# EasyEDA schematic Voltage Mode Buck- Voltage_Current Control Module.json

## Sheets
1 Sheet_1: TITLE: Sheet_1; REV: 1.0; Date: 2019-04-22; Sheet: 1/1; Drawn By: neutronstriker; Company: Your Company
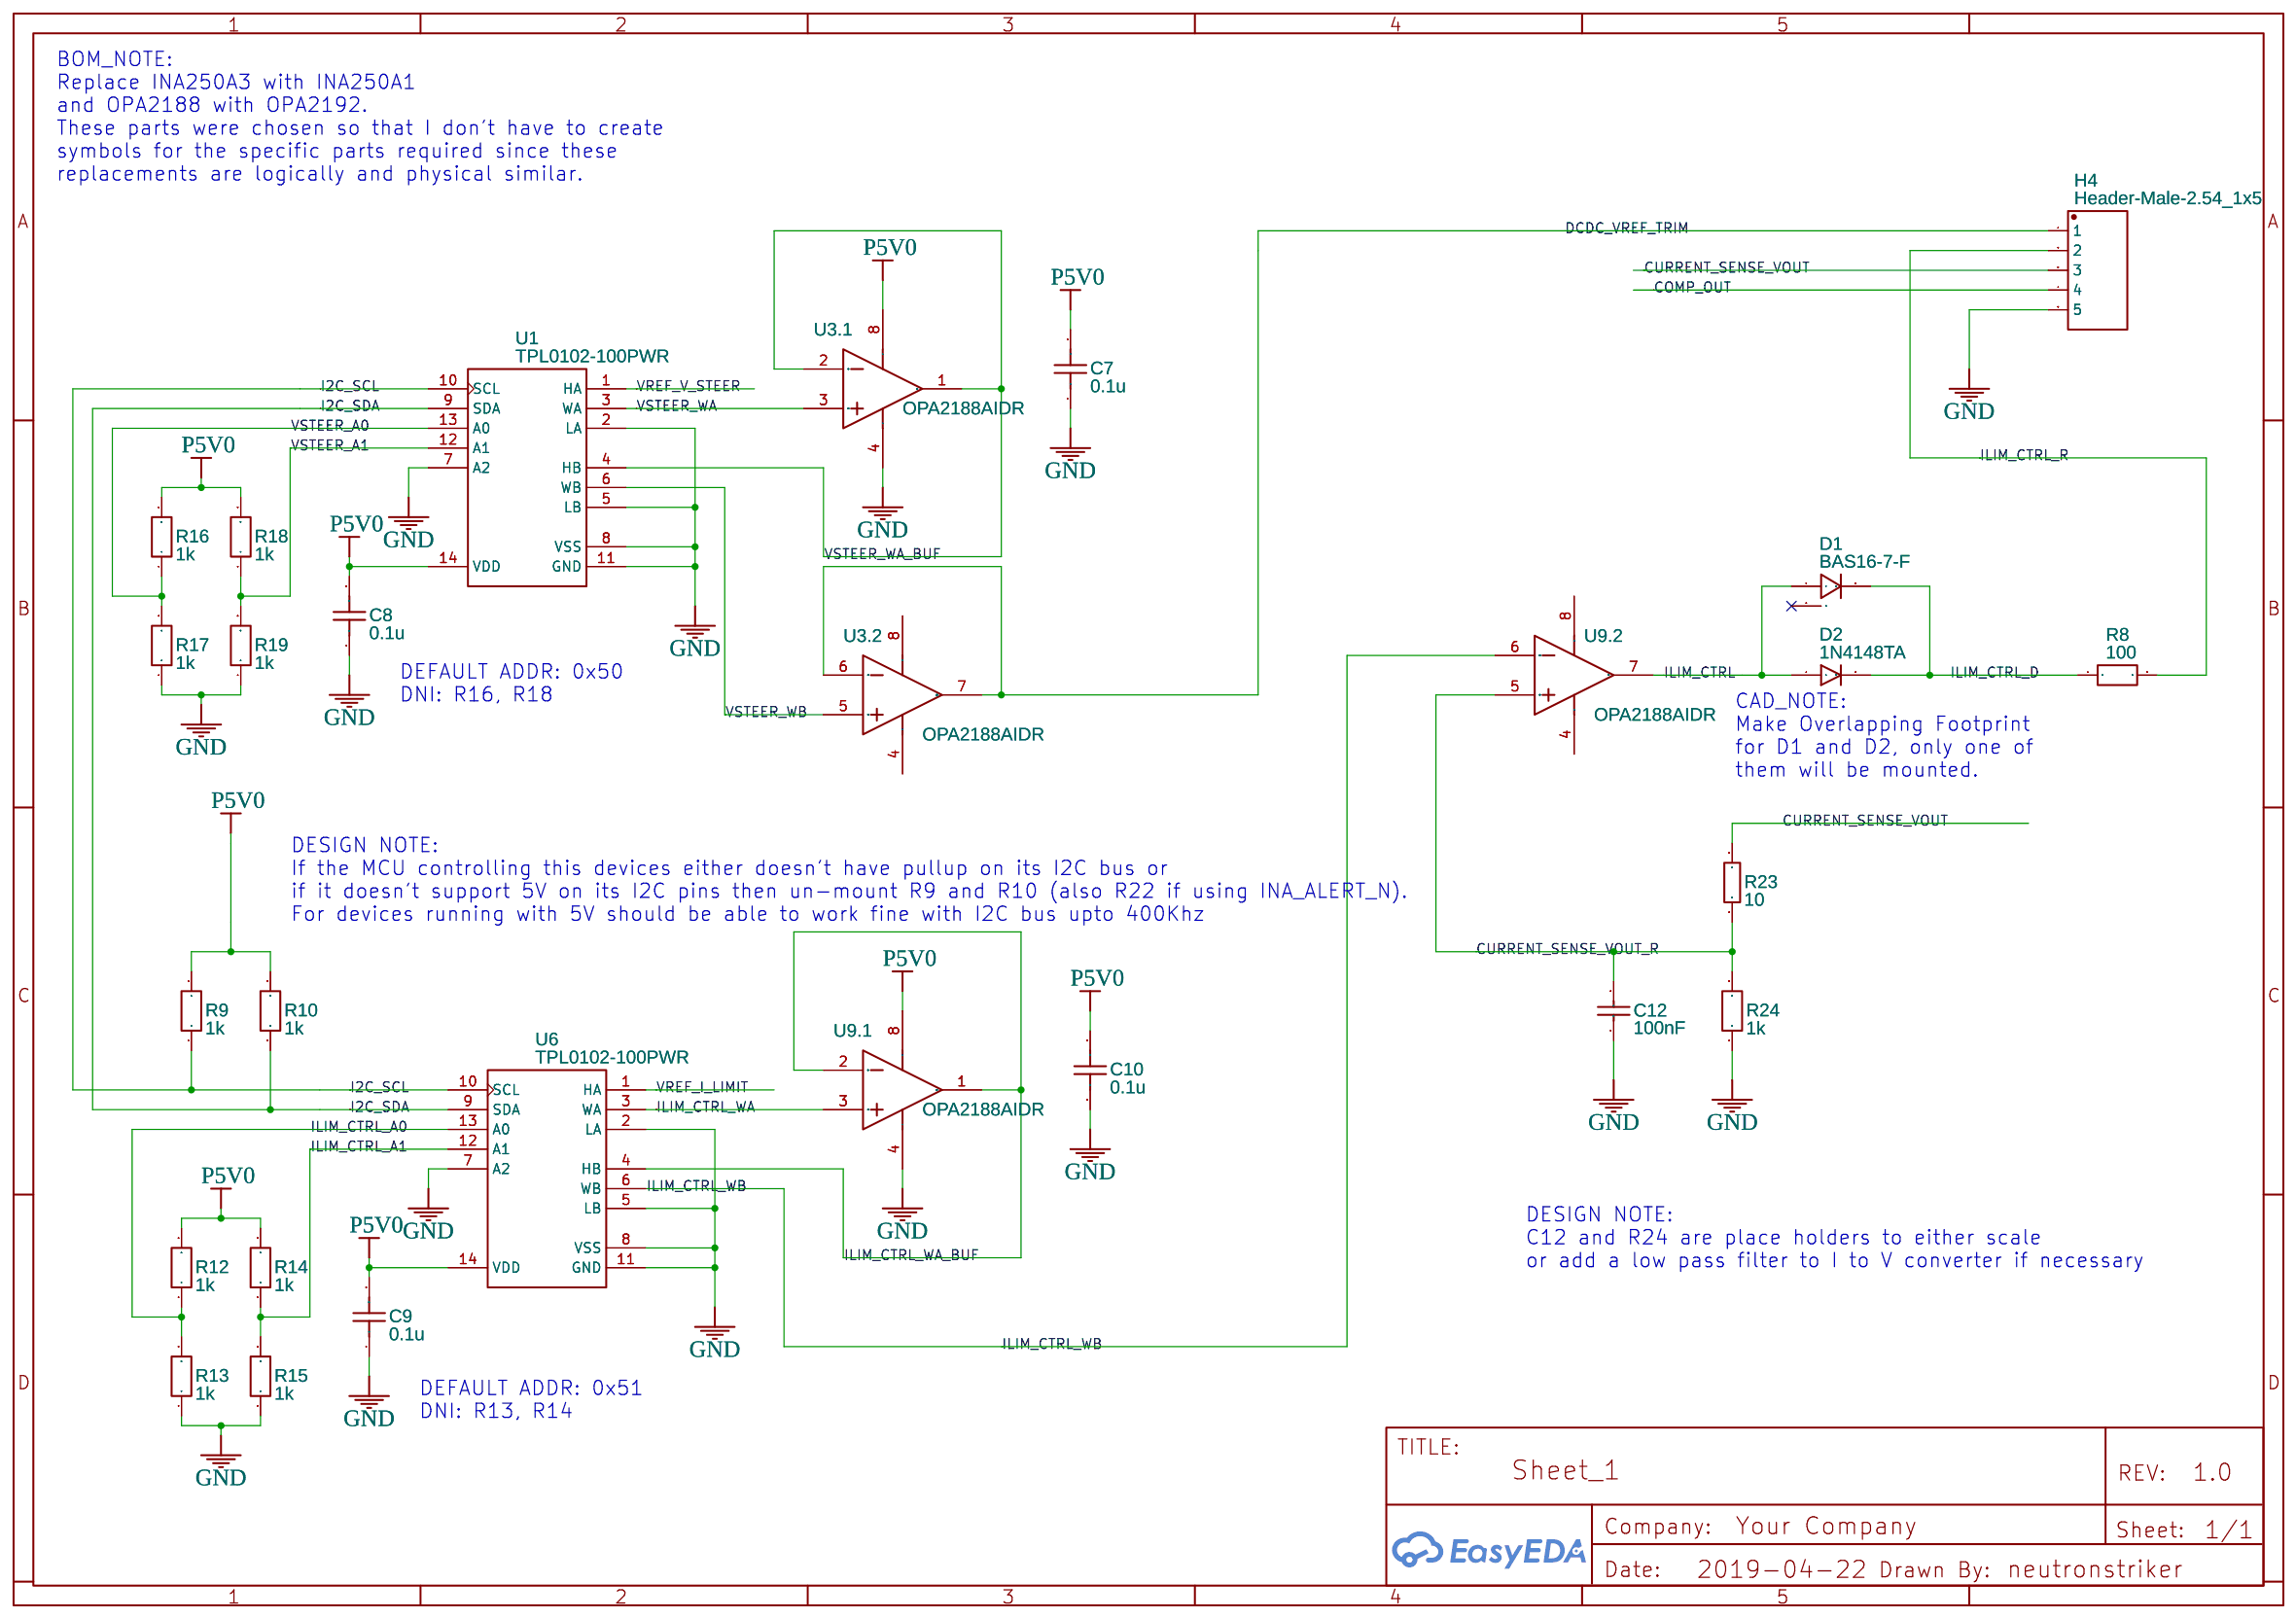
[diagram p0: Sheet_1]
2 Sheet_2: TITLE: Sheet_2; Date: 2019-05-24
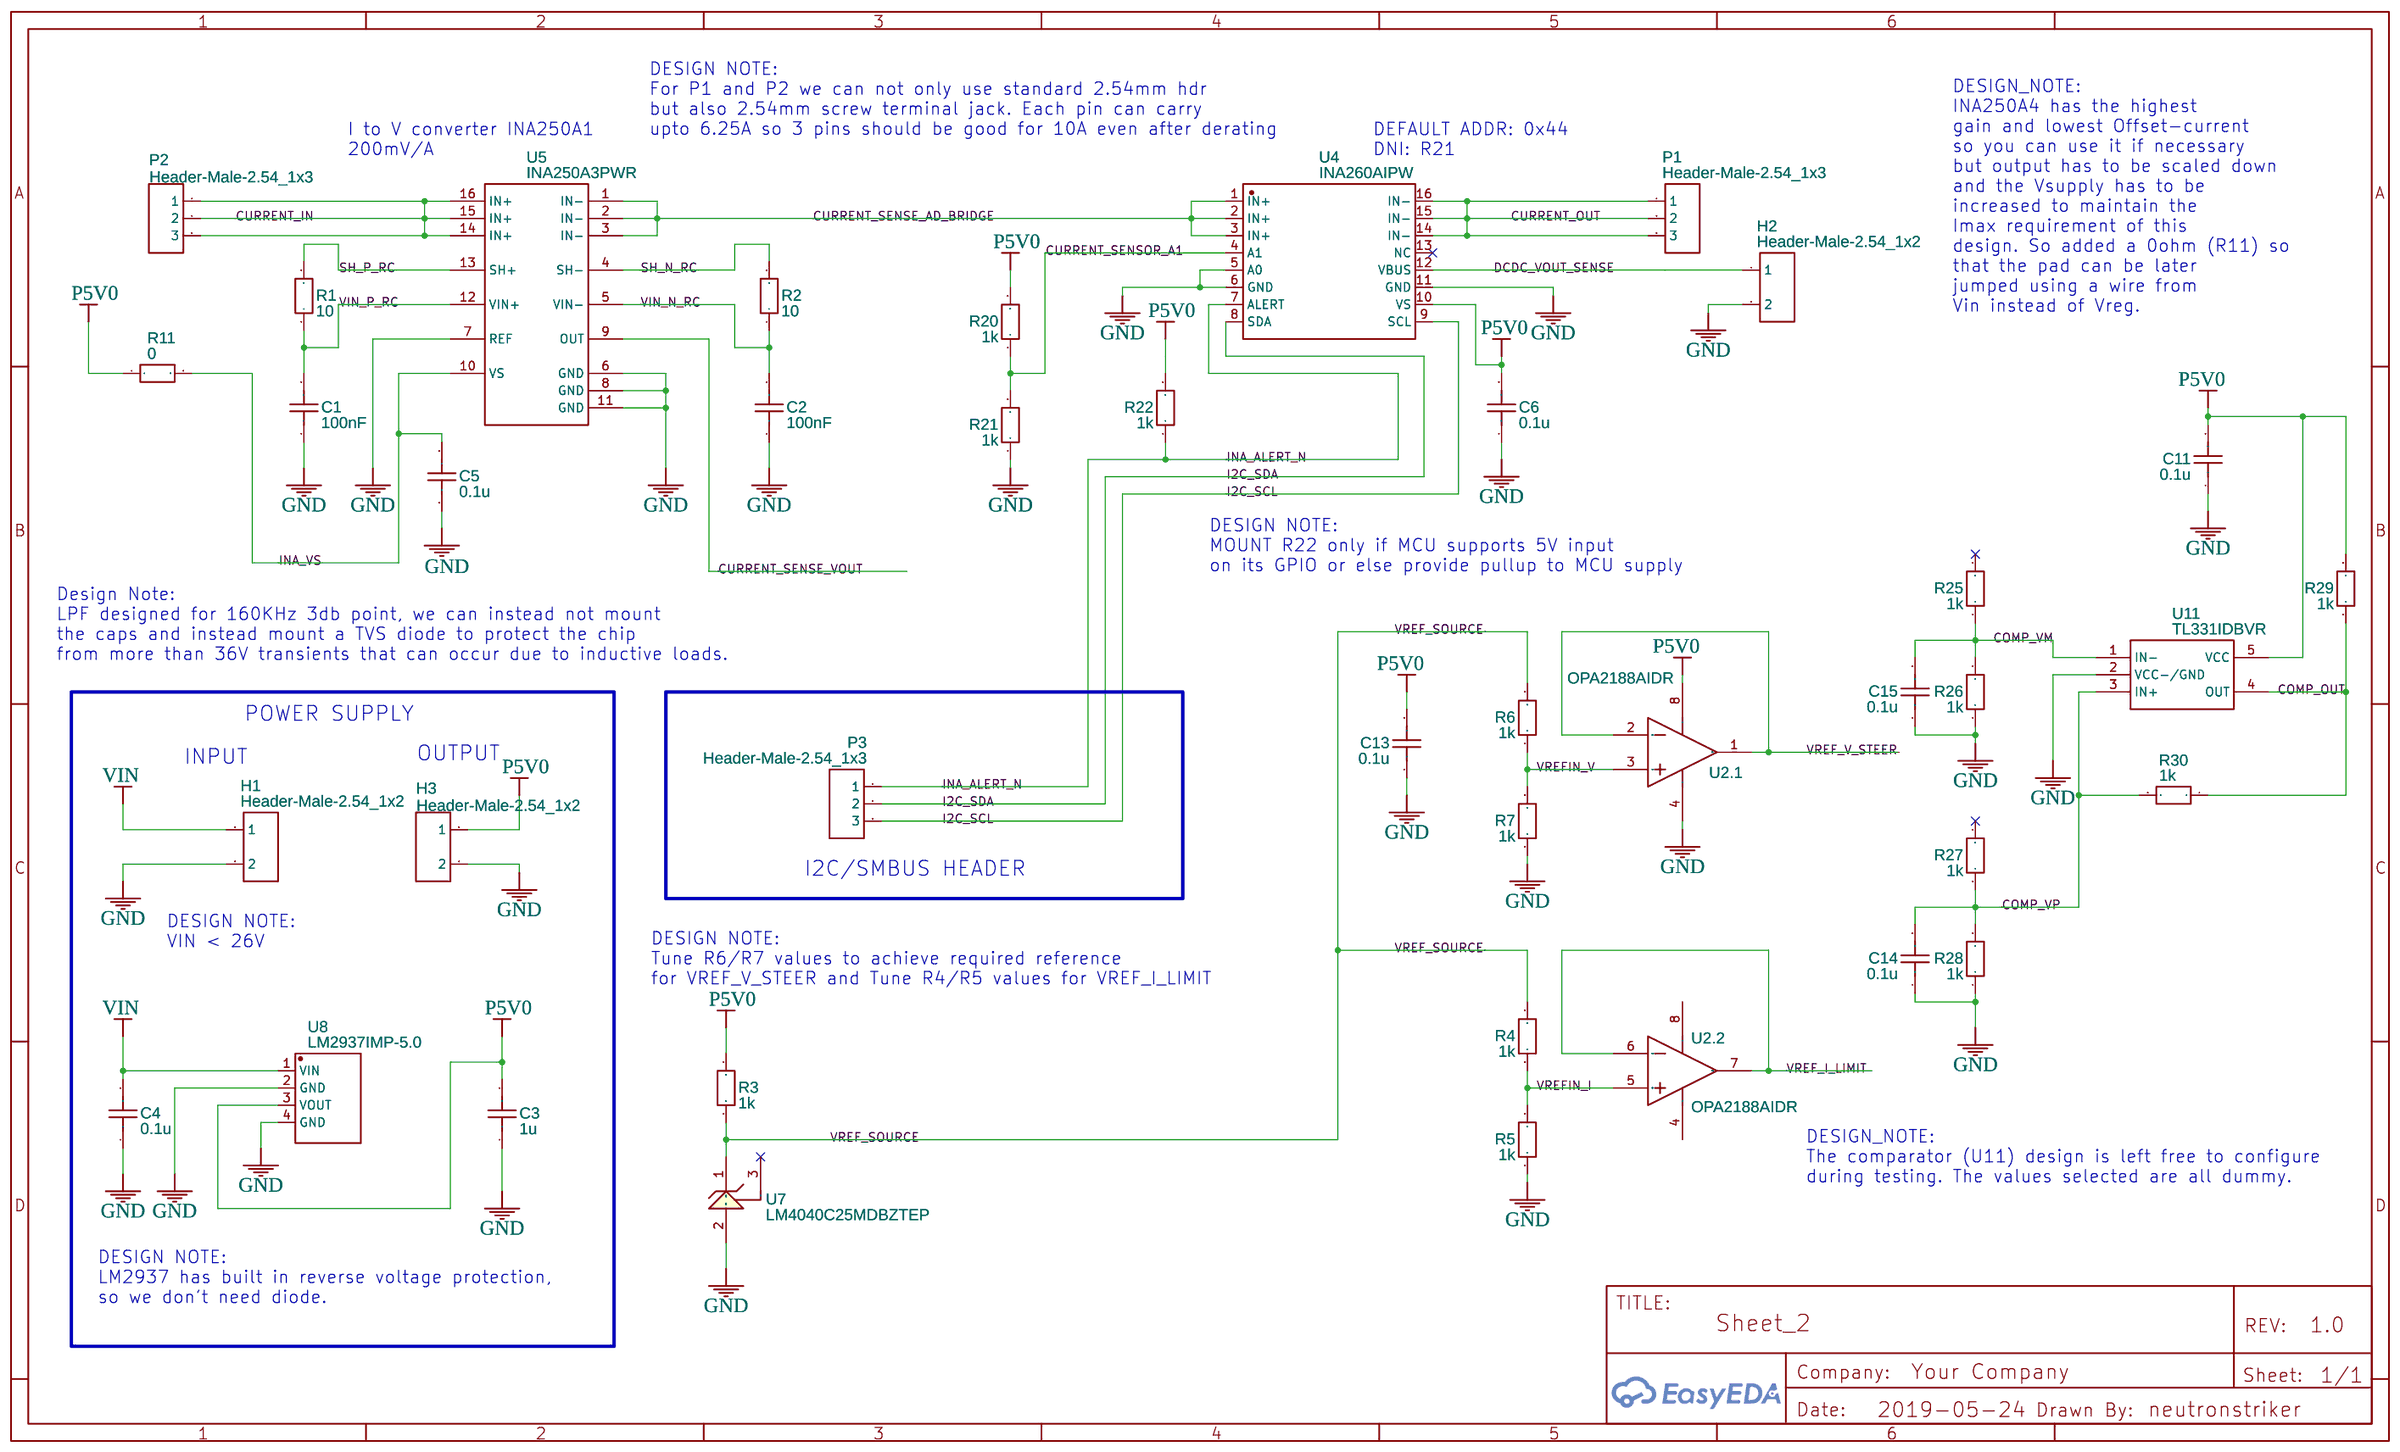
[diagram p1: Sheet_2]

## Parts
sheet Sheet_1
C7  0.1u  [0805]
C8  0.1u  [0805]
C9  0.1u  [0805]
C10  0.1u  [0805]
C12  100nF  [0805]
D1  BAS16-7-F  [SOT-23(SOT-23-3)]
D2  1N4148TA  [DO-35]
H4  Header-Male-2.54_1x5  [DIP-1X5P-2.54MM-M]
R8  100  [0805]
R9  1k  [0805]
R10  1k  [0805]
R12  1k  [0805]
R13  1k  [0805]
R14  1k  [0805]
R15  1k  [0805]
R16  1k  [0805]
R17  1k  [0805]
R18  1k  [0805]
R19  1k  [0805]
R23  10  [0805]
R24  1k  [0805]
U1  TPL0102-100PWR  [TSSOP-14]
U3  OPA2188AIDR  [SOIC-8_150MIL]  (sections 1,2)
U6  TPL0102-100PWR  [TSSOP-14]
U9  OPA2188AIDR  [SOIC-8_150MIL]  (sections 1,2)
sheet Sheet_2
C1  100nF  [0402]
C2  100nF  [0402]
C3  1u  [0805]
C4  0.1u  [0805]
C5  0.1u  [0805]
C6  0.1u  [0805]
C11  0.1u  [0805]
C13  0.1u  [0805]
C14  0.1u  [0805]
C15  0.1u  [0805]
H1  Header-Male-2.54_1x2  [HDR-2X1/2.54]
H2  Header-Male-2.54_1x2  [HDR-2X1/2.54]
H3  Header-Male-2.54_1x2  [HDR-2X1/2.54]
P1  Header-Male-2.54_1x3  [HDR-3X1/2.54]
P2  Header-Male-2.54_1x3  [HDR-3X1/2.54]
P3  Header-Male-2.54_1x3  [HDR-3X1/2.54]
R1  10  [0402]
R2  10  [0402]
R3  1k  [0805]
R4  1k  [0805]
R5  1k  [0805]
R6  1k  [0805]
R7  1k  [0805]
R11  0  [0805]
R20  1k  [0805]
R21  1k  [0805]
R22  1k  [0805]
R25  1k  [0805]
R26  1k  [0805]
R27  1k  [0805]
R28  1k  [0805]
R29  1k  [0805]
R30  1k  [0805]
U2  OPA2188AIDR  [SOIC-8_150MIL]  (sections 1,2)
U4  INA260AIPW  [TSSOP-16]
U5  INA250A3PWR  [TSSOP-16]
U7  LM4040C25MDBZTEP  [SOT23-3]
U8  LM2937IMP-5.0  [SOT-223]
U11  TL331IDBVR  [SOT-23-5]

## Library data of the parts
C3-C11 C13-C15 = Cap_0805_US: Manufacturer Part: ?
C12 = CL21B104JBCNNNC: Supplier: LCSC; Manufacturer: SAMSUNG; Supplier Part: C62912; LCSC Assembly: Yes; SMT Type: Extend; MOUNT: NO
D1 = -: Supplier Part: C69162; Supplier: LCSC; Manufacturer: DIODES; Contributor: LCSC; LCSC Assembly: Yes; SMT Type: Extend
D2 = -: Supplier: LCSC; Manufacturer: FAIRCHILD; Contributor: LCSC; Supplier Part: C124481
H4 = -: Supplier: LCSC; Manufacturer: Ckmtw; Manufacturer Part: 210S-1*5P L=11.6MMGold-plated black; Contributor: LCSC; Supplier Part: C124379
R3 R4 R6-R12 R15 R17 R19 R20 R25-R30 = Res_0805(1/8W)_EU: Manufacturer Part: ?
R5 R13 R14 R16 R18 R21 R22 R24 = Res_0805(1/8W)_EU: Manufacturer Part: ?; MOUNT: NO
R23 = AC0805FR-0710RL: Supplier: LCSC; Manufacturer: YAGEO; Supplier Part: C138273
U1 U6 = -: 256 Tap Dual Channel Digital Potentiometer with I2C Interface and Non-Volatile Memory, -40 to 85 degC, 14-pin SOP (PW14), Green (RoHS  no SbBr); Manufacturer Part: ?
U2 U3 U9 = -: tags: Precision Operational Amplifier; Supplier Part: C17271; Supplier: LCSC; Manufacturer: TI; subpart_no: 1; image: http://image.lceda.cn/szlcsc/C17271.jpg
C1 C2 = Cap_0402_US: Manufacturer Part: ?
H1-H3 = -: Supplier: LCSC; Manufacturer: TE Connectivity; Manufacturer Part: 826629-2; image: //image.lceda.cn/szlcsc/C86471.jpg; Supplier Part: C86471
P1-P3 = -: Supplier: LCSC; Manufacturer: BOOMELE; Manufacturer Part: Header2.54mm 1*3P; image: //image.lceda.cn/szlcsc/C49257.jpg; Supplier Part: C49257
R1 R2 = Res_0402(1/16W)_EU: Manufacturer Part: ?
U4 = -: Supplier: LCSC; Supplier Part: C181331; Manufacturer: Texas Instruments; Contributor: LCSC
U5 = -: Supplier: LCSC; Supplier Part: C122578; Manufacturer: Texas Instruments; Contributor: neutronstriker; LCSC Assembly: Yes; SMT Type: Extend
U7 = -: Enhanced Product Precision Micropower Shunt Voltage Reference, 0.5% accuracy, 15 ppm  degC, 15 mA, -55 to 125 degC, 3-pin SOT-23 (DBZ), Green (RoHS  no SbBr); Manufacturer Part: ?
U8 = -: Supplier: LCSC; Manufacturer: TI; image: //image.lceda.cn/szlcsc/C42249.jpg; Supplier Part: C42249
U11 = -: Supplier: LCSC; Manufacturer: TI; Supplier Part: C80942; LCSC Assembly: Yes; SMT Type: Extend

## Nets
GND: C1.1 C2.1 C3.1 C4.1 C5.1 C6.1 C7.1 C8.1 C9.1 C10.1 C11.1 C12.1 C13.1 C14.1 C15.1 H1.2 H2.2 H3.2 H4.5 R5.1 R7.1 R13.1 R15.1 R17.1 R19.1 R21.1 R24.1 R26.1 R28.1 U1.2(LA) U1.5(LB) U1.7(A2) U1.8(VSS) U1.11(GND) U2.4(V-) U3.4(V-) U4.5(A0) U4.6(GND) U4.11(GND) U5.6(GND) U5.7(REF) U5.8(GND) U5.11(GND) U6.2(LA) U6.5(LB) U6.7(A2) U6.8(VSS) U6.11(GND) U7.2(ANODE) U8.2(GND) U8.4(GND) U9.4(V-) U11.2(VCC-/GND)
P5V0: C3.2 C6.2 C7.2 C8.2 C9.2 C10.2 C11.2 C13.2 H3.1 R3.2 R9.2 R10.2 R11.1 R12.2 R14.2 R16.2 R18.2 R20.2 R22.2 R29.2 U1.14(VDD) U2.8(V+) U3.8(V+) U4.10(VS) U6.14(VDD) U8.3(VOUT) U9.8(V+) U11.5(VCC)
VIN: C4.2 H1.1 U8.1(VIN)
VIN_N_RC: C2.2 R2.1 U5.5(VIN-)
VIN_P_RC: C1.2 R1.1 U5.12(VIN+)
COMP_OUT: H4.4 R29.1 R30.1 U11.4(OUT)
COMP_VM: C15.2 R25.1 R26.2 U11.1(IN-)
COMP_VP: C14.2 R27.1 R28.2 R30.2 U11.3(IN+)
CURRENT_IN: P2.1 P2.2 P2.3 U5.14(IN+) U5.15(IN+) U5.16(IN+)
CURRENT_OUT: P1.1 P1.2 P1.3 U4.14(IN-) U4.15(IN-) U4.16(IN-)
CURRENT_SENSE_AD_BRIDGE: U4.1(IN+) U4.2(IN+) U4.3(IN+) U5.1(IN-) U5.2(IN-) U5.3(IN-)
CURRENT_SENSE_VOUT: H4.3 R23.2 U5.9(OUT)
CURRENT_SENSE_VOUT_R: C12.2 R23.1 R24.2 U9.5(IN B+)
CURRENT_SENSOR_A1: R20.1 R21.2 U4.4(A1)
DCDC_VOUT_SENSE: H2.1 U4.12(VBUS)
DCDC_VREF_TRIM: H4.1 U3.6(IN B-) U3.7(OUT B)
I2C_SCL: P3.3 R9.1 U1.10(SCL) U4.9(SCL) U6.10(SCL)
I2C_SDA: P3.2 R10.1 U1.9(SDA) U4.8(SDA) U6.9(SDA)
ILIM_CTRL: D1.1(A) D2.1 U9.7(OUT B)
ILIM_CTRL_A0: R12.1 R13.2 U6.13(A0)
ILIM_CTRL_A1: R14.1 R15.2 U6.12(A1)
ILIM_CTRL_D: D1.3(C) D2.2 R8.1
ILIM_CTRL_R: H4.2 R8.2
ILIM_CTRL_WA: U6.3(WA) U9.3(IN A+)
ILIM_CTRL_WA_BUF: U6.4(HB) U9.1(OUT A) U9.2(IN A-)
ILIM_CTRL_WB: U6.6(WB) U9.6(IN B-)
INA_ALERT_N: P3.1 R22.1 U4.7(ALERT)
INA_VS: C5.2 R11.2 U5.10(VS)
SH_N_RC: R2.2 U5.4(SH-)
SH_P_RC: R1.2 U5.13(SH+)
VREF_I_LIMIT: U2.6(IN B-) U2.7(OUT B) U6.1(HA)
VREF_SOURCE: R3.1 R4.2 R6.2 U7.1(CATHODE)
VREF_V_STEER: U1.1(HA) U2.1(OUT A) U2.2(IN A-)
VREFIN_I: R4.1 R5.2 U2.5(IN B+)
VREFIN_V: R6.1 R7.2 U2.3(IN A+)
VSTEER_A0: R16.1 R17.2 U1.13(A0)
VSTEER_A1: R18.1 R19.2 U1.12(A1)
VSTEER_WA: U1.3(WA) U3.3(IN A+)
VSTEER_WA_BUF: U1.4(HB) U3.1(OUT A) U3.2(IN A-)
VSTEER_WB: U1.6(WB) U3.5(IN B+)

Not connected (* = marked no-connect by the designer): D1 2*; R25 2*; R27 2*; U4 13(NC)*; U7 3(NC)*

## Notes on the sheets
sheet 1
- BOM_NOTE:
  Replace INA250A3 with INA250A1
  and OPA2188 with OPA2192.
  These parts were chosen so that I don't have to create
  symbols for the specific parts required since these
  replacements are logically and physical similar.
- DEFAULT ADDR: 0x50
  DNI: R16, R18
- CAD_NOTE:
  Make Overlapping Footprint
  for D1 and D2, only one of
  them will be mounted.
- DESIGN NOTE:
  If the MCU controlling this devices either doesn't have pullup on its I2C bus or
  if it doesn't support 5V on its I2C pins then un-mount R9 and R10 (also R22 if using INA_ALERT_N).
  For devices running with 5V should be able to work fine with I2C bus upto 400Khz
- DESIGN NOTE:
  C12 and R24 are place holders to either scale
  or add a low pass filter to I to V converter if necessary
- DEFAULT ADDR: 0x51
  DNI: R13, R14
sheet 2
- DESIGN NOTE:
  For P1 and P2 we can not only use standard 2.54mm hdr
  but also 2.54mm screw terminal jack. Each pin can carry
  upto 6.25A so 3 pins should be good for 10A even after derating
- DESIGN_NOTE:
  INA250A4 has the highest
  gain and lowest Offset-current
  so you can use it if necessary
  but output has to be scaled down
  and the Vsupply has to be
  increased to maintain the
  Imax requirement of this
  design. So added a 0ohm (R11) so
  that the pad can be later
  jumped using a wire from
  Vin instead of Vreg.
- I to V converter INA250A1
  200mV/A
- DEFAULT ADDR: 0x44
  DNI: R21
- DESIGN NOTE:
  MOUNT R22 only if MCU supports 5V input
  on its GPIO or else provide pullup to MCU supply
- Design Note:
  LPF designed for 160KHz 3db point, we can instead not mount
  the caps and instead mount a TVS diode to protect the chip
  from more than 36V transients that can occur due to inductive loads.
- POWER SUPPLY
- INPUT
- OUTPUT
- I2C/SMBUS HEADER
- DESIGN NOTE:
  VIN < 26V
- DESIGN NOTE:
  Tune R6/R7 values to achieve required reference
  for VREF_V_STEER and Tune R4/R5 values for VREF_I_LIMIT
- DESIGN_NOTE:
  The comparator (U11) design is left free to configure
  during testing. The values selected are all dummy.
- DESIGN NOTE:
  LM2937 has built in reverse voltage protection,
  so we don't need diode.
